# EAGLE design TeensyAmp_R5.1 (EAGLE 9.6.2)

## Sheet 1 of 3
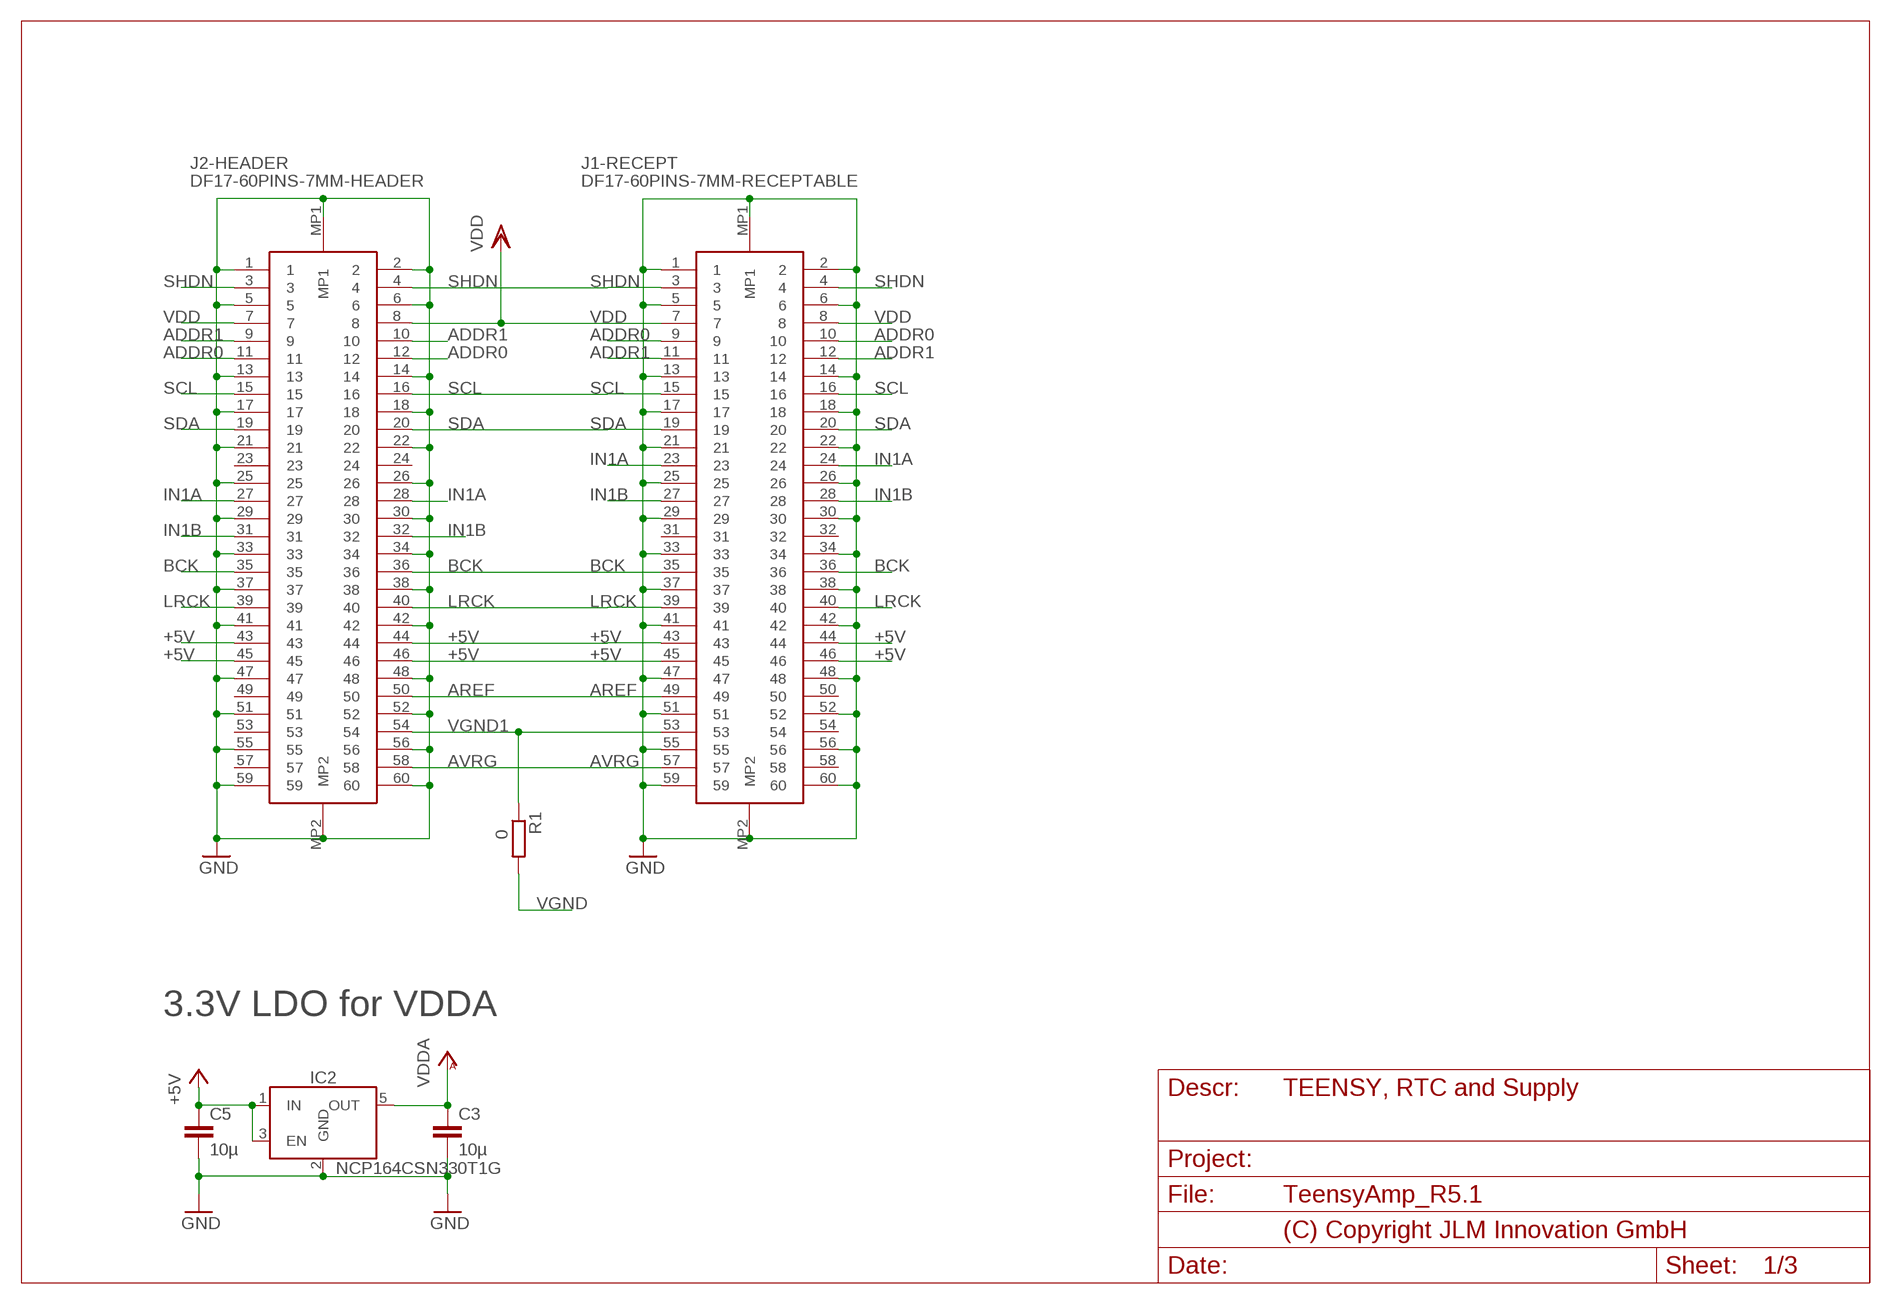
[diagram p0: schematic, sheet 1]
FRAME1 (DINA4_L): PAGE_DESCRIPTION: TEENSY, RTC and Supply

### Parts
C3  10µ  C-EUC0603  [C0603]
C5  10µ  C-EUC0603  [C0603]
IC2  NCP164CSN330T1G  LDO_ENSOT23-5  [SOT23-5]
J1-RECEPT  DF17-60PINS-7MM-RECEPTABLE  [DF173060DS05V57]
J2-HEADER  DF17-60PINS-7MM-HEADER  [DF174060DP05V57]
R1  0  R_JLMR0603  [R0603]

### Nets
+5V: C5.1 IC2.1(IN) IC2.3(EN) J1-RECEPT.43 J1-RECEPT.44 J1-RECEPT.45 J1-RECEPT.46 J2-HEADER.43 J2-HEADER.44 J2-HEADER.45 J2-HEADER.46
ADDR0: J1-RECEPT.9 J1-RECEPT.10 J2-HEADER.11 J2-HEADER.12
ADDR1: J1-RECEPT.11 J1-RECEPT.12 J2-HEADER.9 J2-HEADER.10 ; also sheet 2,3
AREF: J1-RECEPT.49 J2-HEADER.50 ; also sheet 2,3
AVRG: J1-RECEPT.57 J2-HEADER.58 ; also sheet 2,3
BCK: J1-RECEPT.35 J1-RECEPT.36 J2-HEADER.35 J2-HEADER.36 ; also sheet 2,3
GND: C3.2 C5.2 IC2.2(GND) J1-RECEPT.1 J1-RECEPT.2 J1-RECEPT.5 J1-RECEPT.6 J1-RECEPT.13 J1-RECEPT.14 J1-RECEPT.17 J1-RECEPT.18 J1-RECEPT.21 J1-RECEPT.22 J1-RECEPT.25 J1-RECEPT.26 J1-RECEPT.29 J1-RECEPT.30 J1-RECEPT.33 J1-RECEPT.34 J1-RECEPT.37 J1-RECEPT.38 J1-RECEPT.41 J1-RECEPT.42 J1-RECEPT.47 J1-RECEPT.48 J1-RECEPT.51 J1-RECEPT.52 J1-RECEPT.55 J1-RECEPT.56 J1-RECEPT.59 J1-RECEPT.60 J1-RECEPT.MP1 J1-RECEPT.MP2 J2-HEADER.1 J2-HEADER.2 J2-HEADER.5 J2-HEADER.6 J2-HEADER.13 J2-HEADER.14 J2-HEADER.17 J2-HEADER.18 J2-HEADER.21 J2-HEADER.22 J2-HEADER.25 J2-HEADER.26 J2-HEADER.29 J2-HEADER.30 J2-HEADER.33 J2-HEADER.34 J2-HEADER.37 J2-HEADER.38 J2-HEADER.41 J2-HEADER.42 J2-HEADER.47 J2-HEADER.48 J2-HEADER.51 J2-HEADER.52 J2-HEADER.55 J2-HEADER.56 J2-HEADER.59 J2-HEADER.60 J2-HEADER.MP1 J2-HEADER.MP2 ; also sheet 2,3
IN1A: J1-RECEPT.23 J1-RECEPT.24 J2-HEADER.27 J2-HEADER.28 ; also sheet 2,3
IN1B: J1-RECEPT.27 J1-RECEPT.28 J2-HEADER.31 J2-HEADER.32
LRCK: J1-RECEPT.39 J1-RECEPT.40 J2-HEADER.39 J2-HEADER.40 ; also sheet 2,3
SCL: J1-RECEPT.15 J1-RECEPT.16 J2-HEADER.15 J2-HEADER.16 ; also sheet 2,3
SDA: J1-RECEPT.19 J1-RECEPT.20 J2-HEADER.19 J2-HEADER.20 ; also sheet 2,3
SHDN: J1-RECEPT.3 J1-RECEPT.4 J2-HEADER.3 J2-HEADER.4 ; also sheet 2,3
VDD: J1-RECEPT.7 J1-RECEPT.8 J2-HEADER.7 J2-HEADER.8 ; also sheet 2,3
VDDA: C3.1 IC2.5(OUT) ; also sheet 2,3
VGND: R1.2 ; also sheet 2,3
VGND1: J1-RECEPT.53 J2-HEADER.54 R1.1
Unconnected: J1-RECEPT.31 J1-RECEPT.32 J1-RECEPT.50 J1-RECEPT.54 J1-RECEPT.58 J2-HEADER.23 J2-HEADER.24 J2-HEADER.49 J2-HEADER.53 J2-HEADER.57

### Notes on the sheet
- 3.3V LDO for VDDA

## Sheet 2 of 3
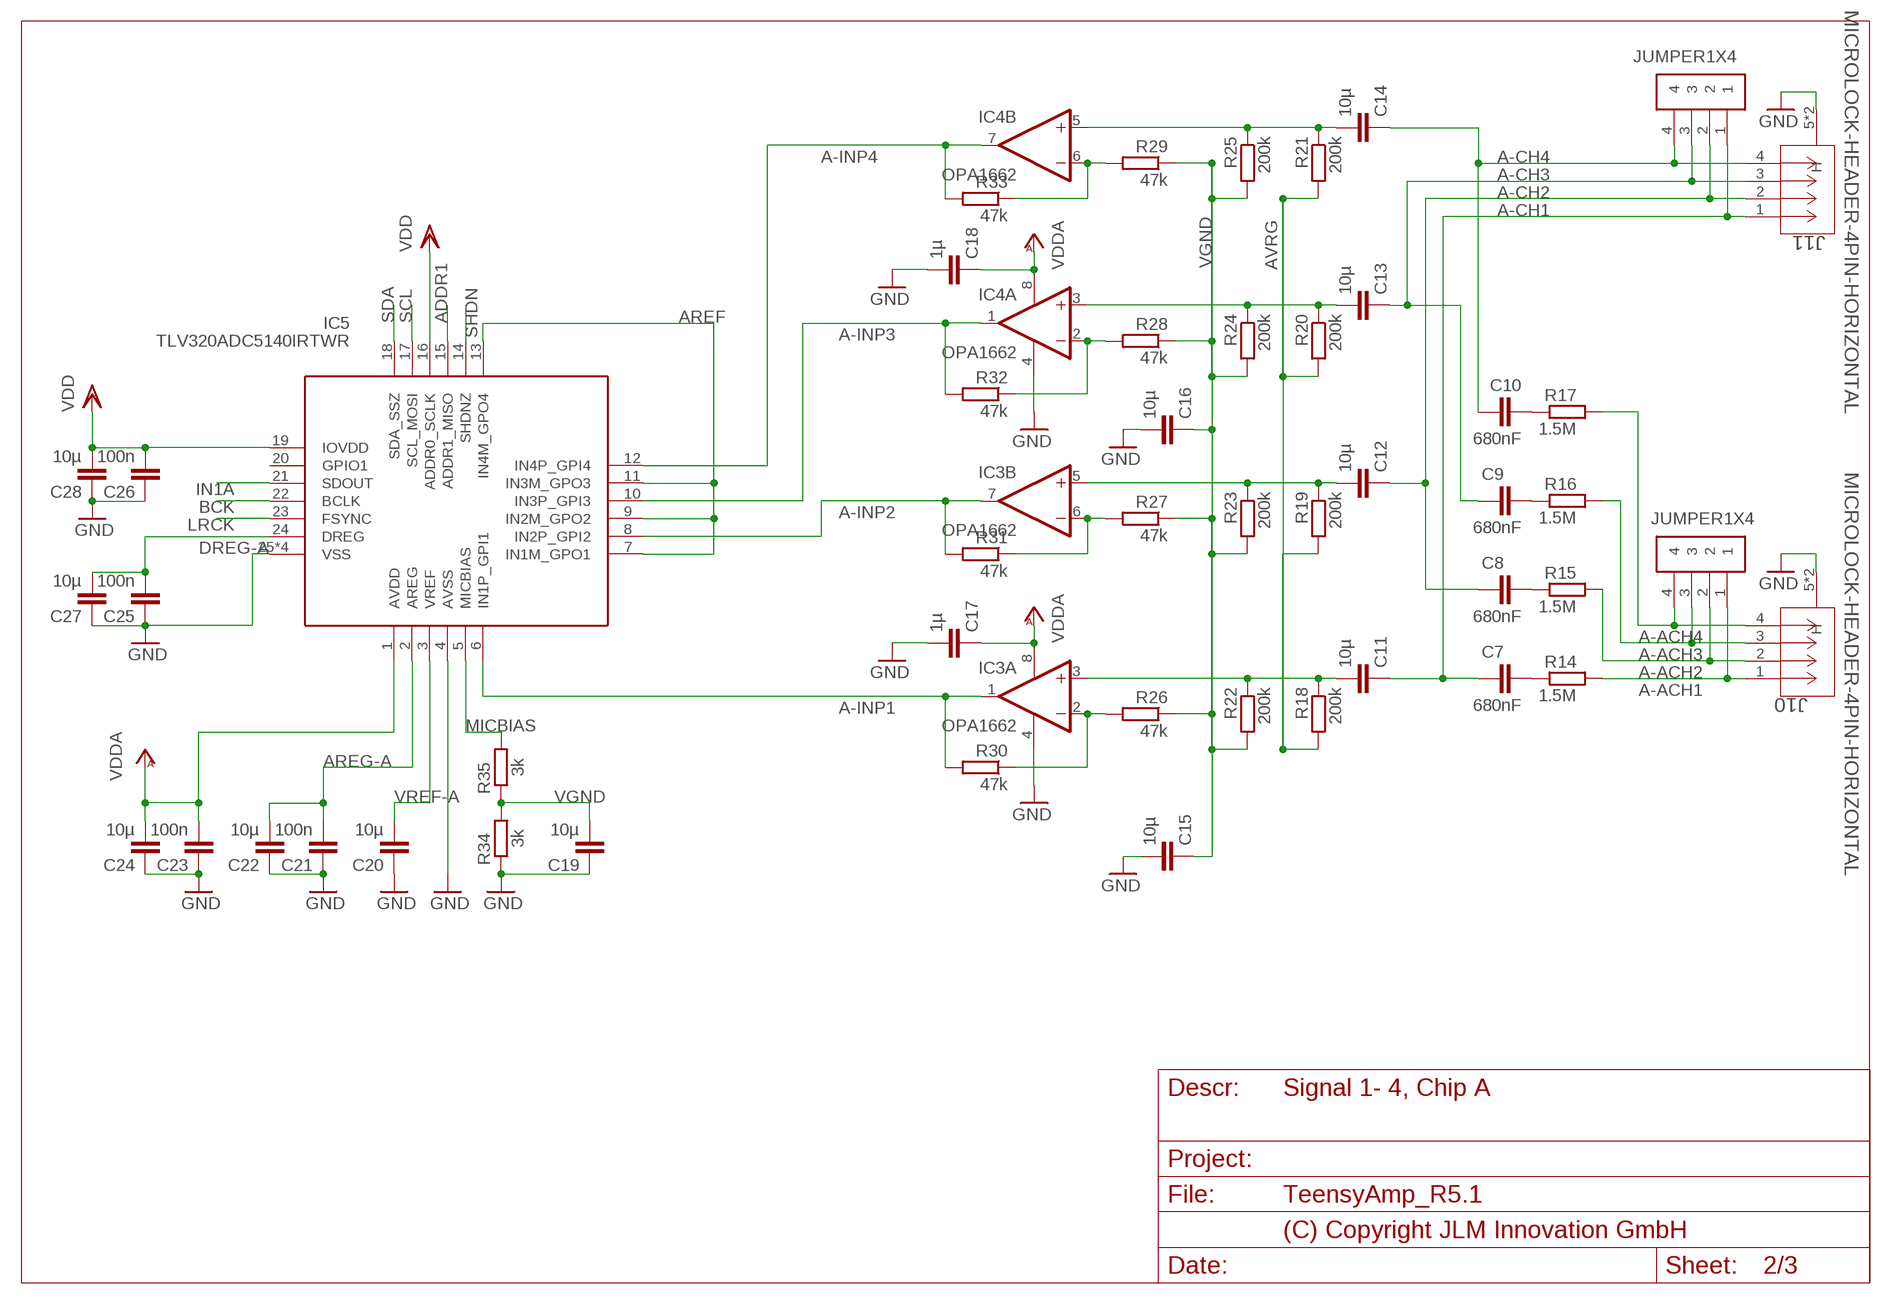
[diagram p1: schematic, sheet 2]
FRAME2 (DINA4_L): PAGE_DESCRIPTION: Signal 1- 4, Chip A

### Parts
C7  680nF  C-EUC0805  [C0805]
C8  680nF  C-EUC0805  [C0805]
C9  680nF  C-EUC0805  [C0805]
C10  680nF  C-EUC0805  [C0805]
C11  10µ  C-EUC0805  [C0805]
C12  10µ  C-EUC0805  [C0805]
C13  10µ  C-EUC0805  [C0805]
C14  10µ  C-EUC0805  [C0805]
C15  10µ  C-EUC0603  [C0603]
C16  10µ  C-EUC0603  [C0603]
C17  1µ  C-EUC0603  [C0603]
C18  1µ  C-EUC0603  [C0603]
C19  10µ  C-EUC0603  [C0603]
C20  10µ  C-EUC0603  [C0603]
C21  100n  C-EUC0603  [C0603]
C22  10µ  C-EUC0603  [C0603]
C23  100n  C-EUC0603  [C0603]
C24  10µ  C-EUC0603  [C0603]
C25  100n  C-EUC0603  [C0603]
C26  100n  C-EUC0603  [C0603]
C27  10µ  C-EUC0603  [C0603]
C28  10µ  C-EUC0603  [C0603]
IC3  OPA1662  OPA2344E  [MSOP08]
IC4  OPA1662  OPA2344E  [MSOP08]
IC5  TLV320ADC5140IRTWR  [QFN50P400X400X80-25N]
J10  MICROLOCK-HEADER-4PIN-HORIZONTAL  [CONN04_5055670471_MOL]
J11  MICROLOCK-HEADER-4PIN-HORIZONTAL  [CONN04_5055670471_MOL]
J12  JUMPER1X4  [JMP1X4]
J13  JUMPER1X4  [JMP1X4]
R14  1.5M  R_JLMR0603  [R0603]
R15  1.5M  R_JLMR0603  [R0603]
R16  1.5M  R_JLMR0603  [R0603]
R17  1.5M  R_JLMR0603  [R0603]
R18  200k  R_JLMR0603  [R0603]
R19  200k  R_JLMR0603  [R0603]
R20  200k  R_JLMR0603  [R0603]
R21  200k  R_JLMR0603  [R0603]
R22  200k  R_JLMR0603  [R0603]
R23  200k  R_JLMR0603  [R0603]
R24  200k  R_JLMR0603  [R0603]
R25  200k  R_JLMR0603  [R0603]
R26  47k  R_JLMR0603  [R0603]
R27  47k  R_JLMR0603  [R0603]
R28  47k  R_JLMR0603  [R0603]
R29  47k  R_JLMR0603  [R0603]
R30  47k  R_JLMR0603  [R0603]
R31  47k  R_JLMR0603  [R0603]
R32  47k  R_JLMR0603  [R0603]
R33  47k  R_JLMR0603  [R0603]
R34  3k  R_JLMR0603  [R0603]
R35  3k  R_JLMR0603  [R0603]

### Nets
A-ACH1: J10.1 J12.1 R14.1
A-ACH2: J10.2 J12.2 R15.1
A-ACH3: J10.3 J12.3 R16.1
A-ACH4: J10.4 J12.4 R17.1
A-CH1: C7.2 C11.1 J11.1 J13.1
A-CH2: C8.2 C12.1 J11.2 J13.2
A-CH3: C9.2 C13.1 J11.3 J13.3
A-CH4: C10.2 C14.1 J11.4 J13.4
A-INP1: IC3.1(A:OUT) IC5.6(IN1P_GPI1) R30.2
A-INP2: IC3.7(B:OUT) IC5.8(IN2P_GPI2) R31.2
A-INP3: IC4.1(A:OUT) IC5.10(IN3P_GPI3) R32.2
A-INP4: IC4.7(B:OUT) IC5.12(IN4P_GPI4) R33.2
ADDR1: IC5.15(ADDR1_MISO) ; also sheet 1,3
AREF: IC5.7(IN1M_GPO1) IC5.9(IN2M_GPO2) IC5.11(IN3M_GPO3) IC5.13(IN4M_GPO4) ; also sheet 1,3
AREG-A: C21.2 C22.2 IC5.2(AREG)
AVRG: R18.2 R19.2 R20.2 R21.2 ; also sheet 1,3
BCK: IC5.22(BCLK) ; also sheet 1,3
DREG-A: C25.2 C27.2 IC5.24(DREG)
GND: C15.2 C16.2 C17.2 C18.2 C19.1 C20.1 C21.1 C22.1 C23.1 C24.1 C25.1 C26.1 C27.1 C28.1 IC3.4(A:V-) IC4.4(A:V-) IC5.4(AVSS) IC5.25(VSS) IC5.26(VSS) IC5.27(VSS) IC5.28(VSS) J10.5(H) J10.6(H) J11.5(H) J11.6(H) R34.1 ; also sheet 1,3
IN1A: IC5.21(SDOUT) ; also sheet 1,3
LRCK: IC5.23(FSYNC) ; also sheet 1,3
MICBIAS: IC5.5(MICBIAS) R35.2
N$6: C13.2 IC4.3(A:+IN) R20.1 R24.1
N$8: C14.2 IC4.5(B:+IN) R21.1 R25.1
N$9: C11.2 IC3.3(A:+IN) R18.1 R22.1
N$10: C12.2 IC3.5(B:+IN) R19.1 R23.1
N$13: IC3.6(B:-IN) R27.2 R31.1
N$15: C7.1 R14.2
N$16: C8.1 R15.2
N$18: C9.1 R16.2
N$27: C10.1 R17.2
N$31: IC4.2(A:-IN) R28.2 R32.1
N$32: IC4.6(B:-IN) R29.2 R33.1
N$33: IC3.2(A:-IN) R26.2 R30.1
SCL: IC5.17(SCL_MOSI) ; also sheet 1,3
SDA: IC5.18(SDA_SSZ) ; also sheet 1,3
SHDN: IC5.14(SHDNZ) ; also sheet 1,3
VDD: C26.2 C28.2 IC5.16(ADDR0_SCLK) IC5.19(IOVDD) ; also sheet 1,3
VDDA: C17.1 C18.1 C23.2 C24.2 IC3.8(A:V+) IC4.8(A:V+) IC5.1(AVDD) ; also sheet 1,3
VGND: C15.1 C16.1 C19.2 R22.2 R23.2 R24.2 R25.2 R26.1 R27.1 R28.1 R29.1 R34.2 R35.1 ; also sheet 1,3
VREF-A: C20.2 IC5.3(VREF)
Unconnected: IC5.20(GPIO1)

## Sheet 3 of 3
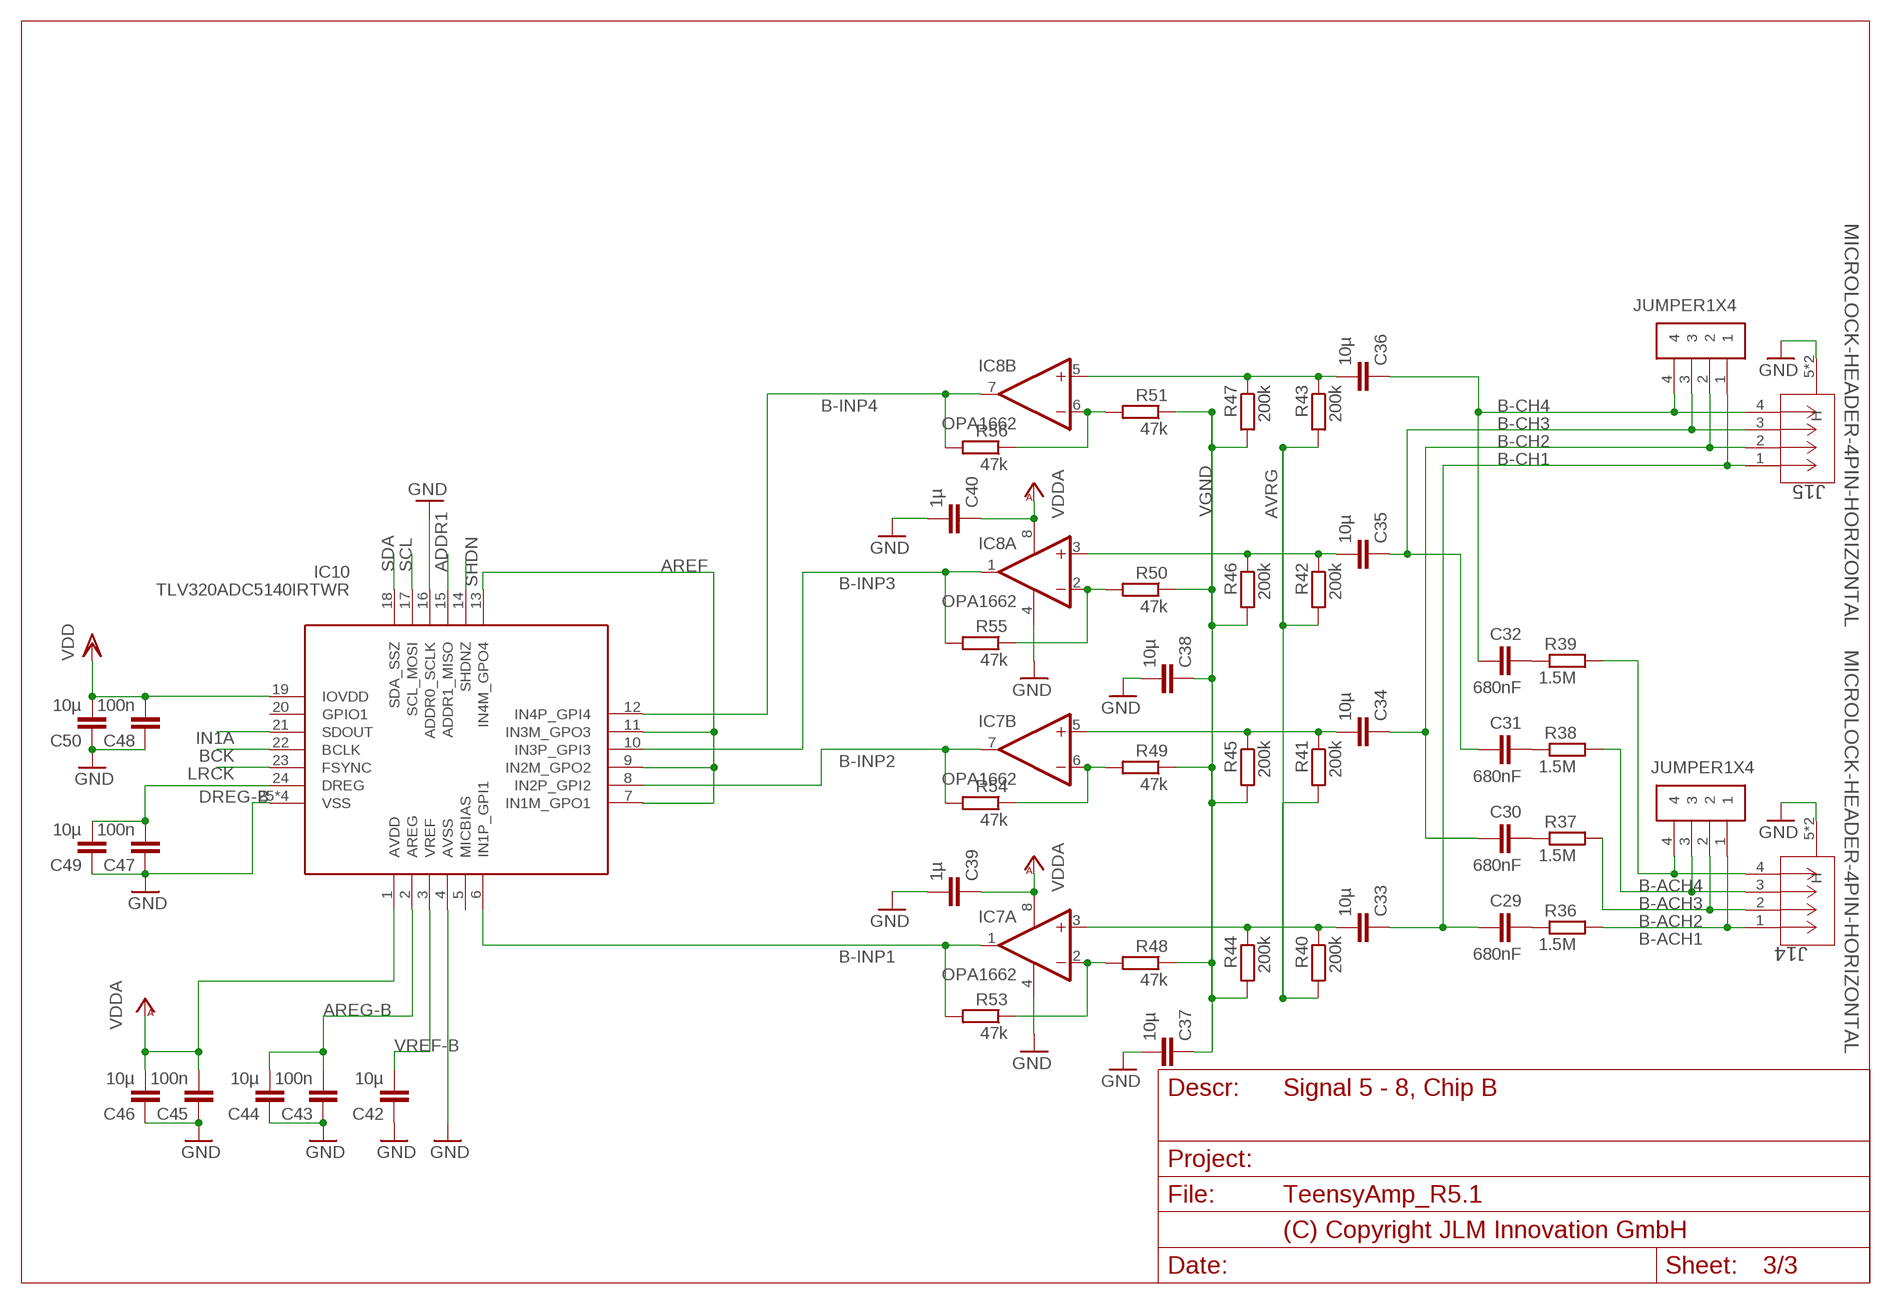
[diagram p2: schematic, sheet 3]
FRAME3 (DINA4_L): PAGE_DESCRIPTION: Signal 5 - 8, Chip B

### Parts
C29  680nF  C-EUC0805  [C0805]
C30  680nF  C-EUC0805  [C0805]
C31  680nF  C-EUC0805  [C0805]
C32  680nF  C-EUC0805  [C0805]
C33  10µ  C-EUC0805  [C0805]
C34  10µ  C-EUC0805  [C0805]
C35  10µ  C-EUC0805  [C0805]
C36  10µ  C-EUC0805  [C0805]
C37  10µ  C-EUC0603  [C0603]
C38  10µ  C-EUC0603  [C0603]
C39  1µ  C-EUC0603  [C0603]
C40  1µ  C-EUC0603  [C0603]
C42  10µ  C-EUC0603  [C0603]
C43  100n  C-EUC0603  [C0603]
C44  10µ  C-EUC0603  [C0603]
C45  100n  C-EUC0603  [C0603]
C46  10µ  C-EUC0603  [C0603]
C47  100n  C-EUC0603  [C0603]
C48  100n  C-EUC0603  [C0603]
C49  10µ  C-EUC0603  [C0603]
C50  10µ  C-EUC0603  [C0603]
IC7  OPA1662  OPA2344E  [MSOP08]
IC8  OPA1662  OPA2344E  [MSOP08]
IC10  TLV320ADC5140IRTWR  [QFN50P400X400X80-25N]
J14  MICROLOCK-HEADER-4PIN-HORIZONTAL  [CONN04_5055670471_MOL]
J15  MICROLOCK-HEADER-4PIN-HORIZONTAL  [CONN04_5055670471_MOL]
J16  JUMPER1X4  [JMP1X4]
J17  JUMPER1X4  [JMP1X4]
R36  1.5M  R_JLMR0603  [R0603]
R37  1.5M  R_JLMR0603  [R0603]
R38  1.5M  R_JLMR0603  [R0603]
R39  1.5M  R_JLMR0603  [R0603]
R40  200k  R_JLMR0603  [R0603]
R41  200k  R_JLMR0603  [R0603]
R42  200k  R_JLMR0603  [R0603]
R43  200k  R_JLMR0603  [R0603]
R44  200k  R_JLMR0603  [R0603]
R45  200k  R_JLMR0603  [R0603]
R46  200k  R_JLMR0603  [R0603]
R47  200k  R_JLMR0603  [R0603]
R48  47k  R_JLMR0603  [R0603]
R49  47k  R_JLMR0603  [R0603]
R50  47k  R_JLMR0603  [R0603]
R51  47k  R_JLMR0603  [R0603]
R53  47k  R_JLMR0603  [R0603]
R54  47k  R_JLMR0603  [R0603]
R55  47k  R_JLMR0603  [R0603]
R56  47k  R_JLMR0603  [R0603]

### Nets
ADDR1: IC10.15(ADDR1_MISO) ; also sheet 1,2
AREF: IC10.7(IN1M_GPO1) IC10.9(IN2M_GPO2) IC10.11(IN3M_GPO3) IC10.13(IN4M_GPO4) ; also sheet 1,2
AREG-B: C43.2 C44.2 IC10.2(AREG)
AVRG: R40.2 R41.2 R42.2 R43.2 ; also sheet 1,2
B-ACH1: J14.1 J16.1 R36.1
B-ACH2: J14.2 J16.2 R37.1
B-ACH3: J14.3 J16.3 R38.1
B-ACH4: J14.4 J16.4 R39.1
B-CH1: C29.2 C33.1 J15.1 J17.1
B-CH2: C30.2 C34.1 J15.2 J17.2
B-CH3: C31.2 C35.1 J15.3 J17.3
B-CH4: C32.2 C36.1 J15.4 J17.4
B-INP1: IC7.1(A:OUT) IC10.6(IN1P_GPI1) R53.2
B-INP2: IC7.7(B:OUT) IC10.8(IN2P_GPI2) R54.2
B-INP3: IC8.1(A:OUT) IC10.10(IN3P_GPI3) R55.2
B-INP4: IC8.7(B:OUT) IC10.12(IN4P_GPI4) R56.2
BCK: IC10.22(BCLK) ; also sheet 1,2
DREG-B: C47.2 C49.2 IC10.24(DREG)
GND: C37.2 C38.2 C39.2 C40.2 C42.1 C43.1 C44.1 C45.1 C46.1 C47.1 C48.1 C49.1 C50.1 IC7.4(A:V-) IC8.4(A:V-) IC10.4(AVSS) IC10.16(ADDR0_SCLK) IC10.25(VSS) IC10.26(VSS) IC10.27(VSS) IC10.28(VSS) J14.5(H) J14.6(H) J15.5(H) J15.6(H) ; also sheet 1,2
IN1A: IC10.21(SDOUT) ; also sheet 1,2
LRCK: IC10.23(FSYNC) ; also sheet 1,2
N$5: IC8.2(A:-IN) R50.2 R55.1
N$11: IC8.6(B:-IN) R51.2 R56.1
N$12: IC7.2(A:-IN) R48.2 R53.1
N$14: IC7.6(B:-IN) R49.2 R54.1
N$17: C35.2 IC8.3(A:+IN) R42.1 R46.1
N$19: C36.2 IC8.5(B:+IN) R43.1 R47.1
N$20: C33.2 IC7.3(A:+IN) R40.1 R44.1
N$21: C34.2 IC7.5(B:+IN) R41.1 R45.1
N$22: C29.1 R36.2
N$23: C30.1 R37.2
N$25: C31.1 R38.2
N$26: C32.1 R39.2
SCL: IC10.17(SCL_MOSI) ; also sheet 1,2
SDA: IC10.18(SDA_SSZ) ; also sheet 1,2
SHDN: IC10.14(SHDNZ) ; also sheet 1,2
VDD: C48.2 C50.2 IC10.19(IOVDD) ; also sheet 1,2
VDDA: C39.1 C40.1 C45.2 C46.2 IC7.8(A:V+) IC8.8(A:V+) IC10.1(AVDD) ; also sheet 1,2
VGND: C37.1 C38.1 R44.2 R45.2 R46.2 R47.2 R48.1 R49.1 R50.1 R51.1 ; also sheet 1,2
VREF-B: C42.2 IC10.3(VREF)
Unconnected: IC10.5(MICBIAS) IC10.20(GPIO1)

## Library data of the parts
C3 C5 C7-C40 C42-C50 = teensyamp:C-EU: CAPACITOR, European symbol
IC2 = teensyamp:LDO_EN; OC_FARNELL: 3367831; OC_MOUSER: 863-NCP164CSN330T1G
IC3 IC4 IC7 IC8 = teensyamp:OPA2*: Dual Operational Amplifier Low Power, Single-Supply, Rail-To-Rail Operational Amplifier Source: http://focus.ti.com/lit/ds/symlink/opa2345.pdf http://focus.ti.com .. opa241.pdf http://focus.ti.com/lit/ds/symlink/opa2134.pdf
IC5 IC10 = teensyamp:TLV320ADC5140IRTWR: 4-Channel Quad ADC Delta-Sigma 768ksps Serial 24-Pin WQFN EP T/R Source: Datasheet <https://www.ti.com/lit/gpn/TLV320ADC5140>; DESCRIPTION: 4-Channel Quad ADC Delta-Sigma 768ksps Serial 24-Pin WQFN EP T/R; HEIGHT: 0.8mm; MANUFACTURER_NAME: Texas Instruments; MANUFACTURER_PART_NUMBER: TLV320ADC5140IRTWR; MOUSER_PART_NUMBER: 595-V320ADC5140IRTWR; MOUSER_PRICE-STOCK: https://www.mouser.co.uk/ProductDetail/Texas-Instruments/TLV320ADC5140IRTWR?qs=Cb2nCFKsA8oyrIT%252Bcv2aDg%3D%3D
J1-RECEPT = teensyamp:DF17-60PINS-7MM-RECEPTABLE: Hirose DF17 Series 0.5mm 60 Way 2 Row Straight PCB Socket Surface Mount Board to Board Source: Datasheet <https://www.hirose.com/product/document?clcode=CL0683-0006-3-57&productname=DF17(3.0)-60DS-0.5V(57)&series=DF17&documenttype=2DDrawing&lang=en&documentid=0000993481>; DESCRIPTION: Hirose DF17 Series 0.5mm 60 Way 2 Row Straight PCB Socket Surface Mount Board to Board; HEIGHT: 3.65mm; MANUFACTURER_NAME: Hirose; MANUFACTURER_PART_NUMBER: DF17(3.0)-60DS-0.5V(57); MOUSER_PART_NUMBER: 798-DF173060DS05V57; MOUSER_PRICE-STOCK: https://www.mouser.co.uk/ProductDetail/Hirose-Connector/DF173.0-60DS-0.5V57?qs=eDUdFcBPps3N4nQ82enQ9g%3D%3D
J2-HEADER = teensyamp:DF17-60PINS-7MM-HEADER: Hirose DF17 Series, 0.5mm Pitch 60 Way 2 Row Straight PCB Header, Solder Termination, 0.3A Source: Datasheet <https://www.hirose.com/en/product/document?clcode=CL0683-0126-5-57&productname=DF17(4.0)-60DP-0.5V(57)&series=DF17&documenttype=2DDrawing&lang=en&documentid=0000994398>; DESCRIPTION: Hirose DF17 Series, 0.5mm Pitch 60 Way 2 Row Straight PCB Header, Solder Termination, 0.3A; HEIGHT: 6.45mm; MANUFACTURER_NAME: Hirose; MANUFACTURER_PART_NUMBER: DF17(4.0)-60DP-0.5V(57); MOUSER_PART_NUMBER: 798-DF174060DP05V57; MOUSER_PRICE-STOCK: https://www.mouser.co.uk/ProductDetail/Hirose-Connector/DF174.0-60DP-0.5V57?qs=eDUdFcBPps3I8b9%252Bfsb1tQ%3D%3D
J10 J11 J14 J15 = teensyamp:MICROLOCK-HEADER-4PIN-HORIZONTAL: molex micro-lock plus horizontal header 4 pins; COPYRIGHT: Copyright (C) 2025 Ultra Librarian. All rights reserved.; MANUFACTURER_PART_NUMBER: 5055670471; MFR_NAME: Molex Connector Corporation
J12 J13 J16 J17 = teensyamp:JUMPER1X4
R1 R14-R51 R53-R56 = teensyamp:R_JLM: RESISTOR, European symbol

## Net classes
0 default: clearance 0.205 mm

## Board
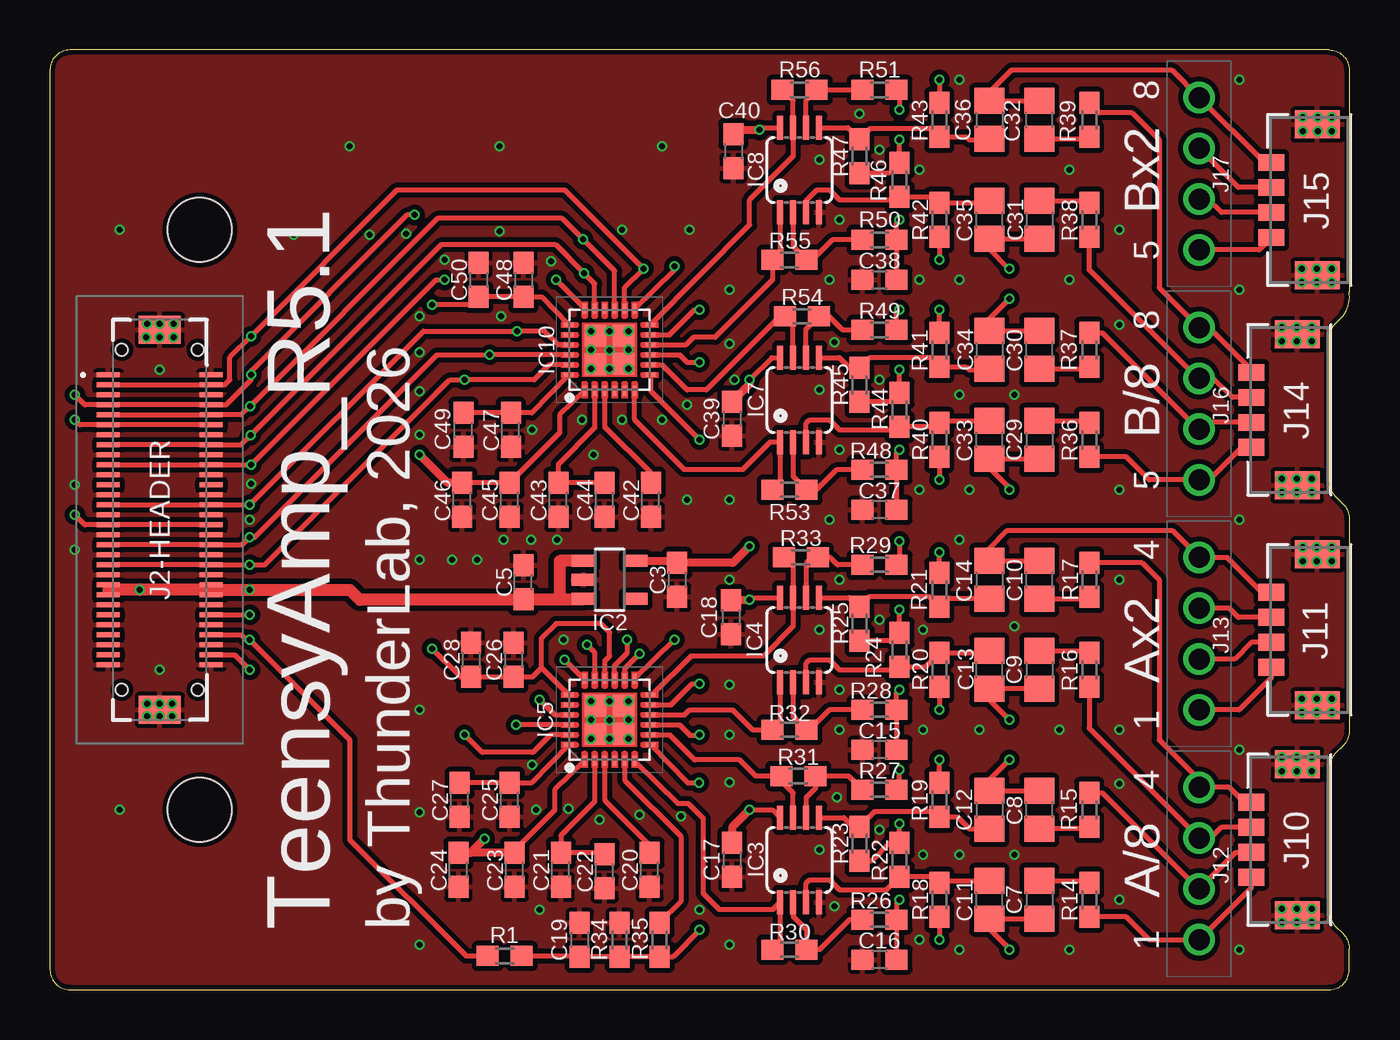
[diagram p3: board, top side]
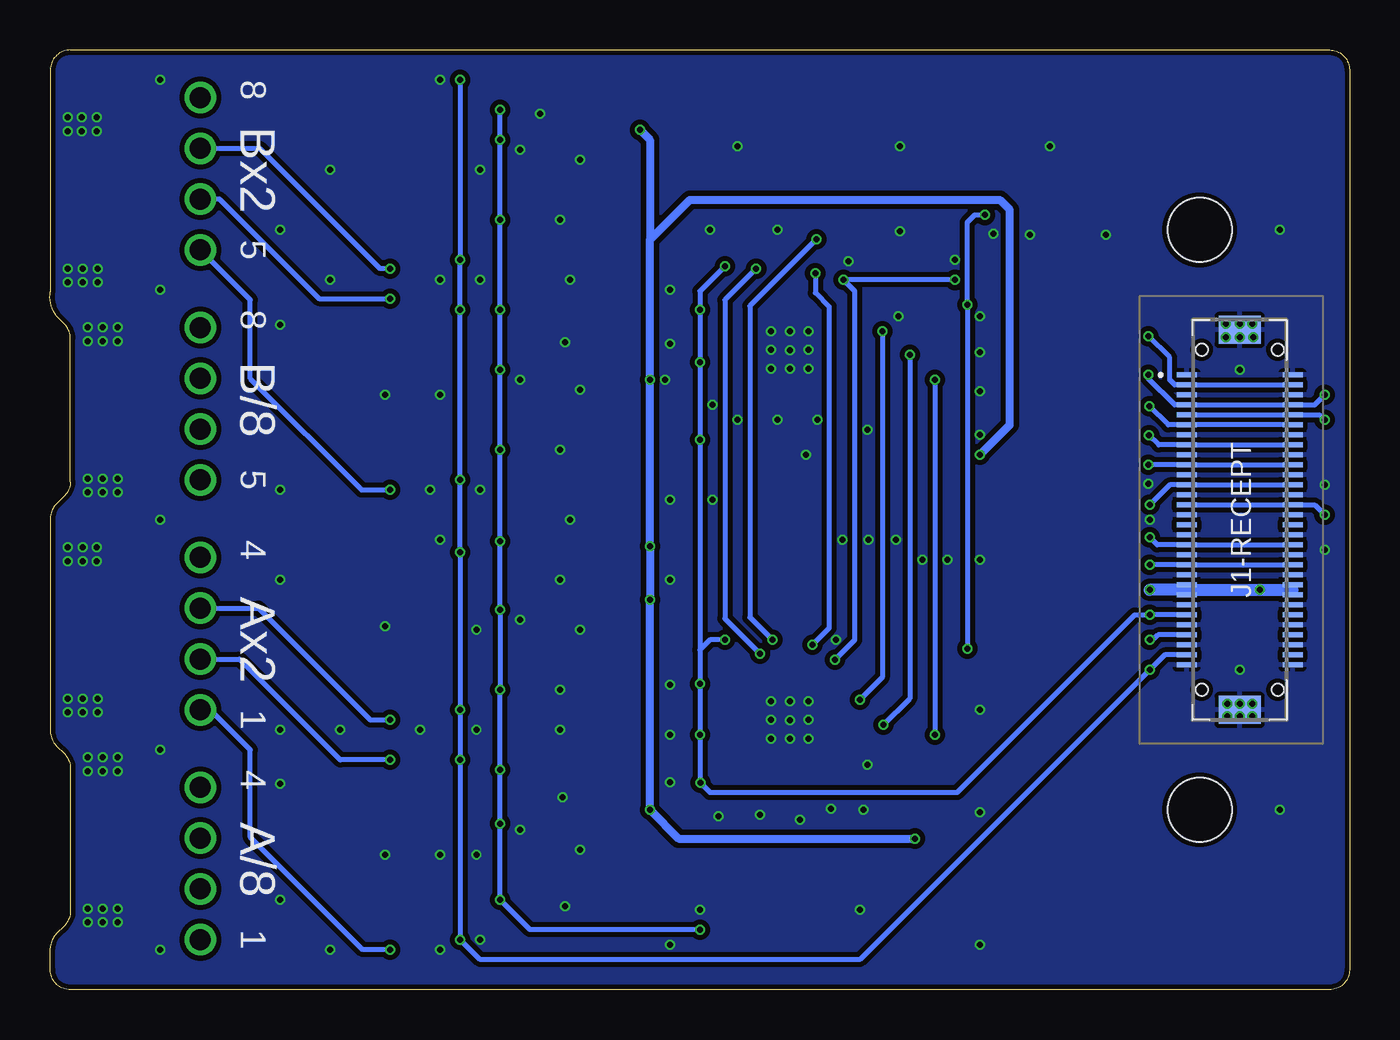
[diagram p4: board, bottom side, seen from below]

Size 65.02 x 47 mm. Coordinates in mm from the lower left corner, seen from the top.
Outline: 0,46 0,1 arc90 1,0 64,0 arc90 65,1 65,2.09 arc45 64.71,2.79 64.29,3.21 arc-45 64,3.91 64,11.09 arc-45 64.29,11.79 64.71,12.21 arc45 65,12.91 65,23.59 arc45 64.71,24.29 64.29,24.71 arc-45 64,25.41 64,32.59 arc-45 64.29,33.29 64.71,33.71 arc45 65,34.91 65,46 arc90 64,47 1,47 arc90 0,46
Copper layers (1*16): Top 0.018mm / dielectric 1.55mm / Bottom 0.018mm
Design rules "Multi-CB_2L_100цm-Tracks_OL35цm *": minimum track width 0.1mm, minimum drill 0.2mm, track to track 0.1mm, track to pad 0.1mm, pad to pad 0.1mm, via to via 0.1mm, smd to smd 0mil, copper to edge 0.2mm, drill to drill 0.2mm, minimum pad ring 0.125mm, minimum via ring 0.1mm, stop-mask expansion 2mil, vias tented up to drill 0.45mm, thermal gap 0.2mm
Holes 3.2 mm at 7.5,9 7.5,38

### Footprints (pad centres in the part's own frame; a part is rotated, then mirrored left to right if it is on the bottom)
C0603 = smd 1.1 x 1: 1 -0.85,0; 2 0.85,0
C0805 = smd 1.3 x 1.5: 1 -0.95,0; 2 0.95,0
SOT23-5 = smd 0.6 x 1.2: 1 -0.95,-1.306; 2 0,-1.306; 3 0.95,-1.306; 4 0.95,1.306; 5 -0.95,1.306
MSOP08 = smd 0.3 x 1.2: 1 -0.976,-2.113; 2 -0.326,-2.113; 3 0.324,-2.113; 4 0.974,-2.113; 5 0.974,2.112; 6 0.324,2.112; 7 -0.326,2.112; 8 -0.976,2.112
QFN50P400X400X80-25N = smd 0.5 x 0.2: 1 -2.05,1.25; 2 -2.05,0.75; 3 -2.05,0.25; 4 -2.05,-0.25; 5 -2.05,-0.75; 6 -2.05,-1.25; 13 2.05,-1.25; 14 2.05,-0.75; 15 2.05,-0.25; 16 2.05,0.25; 17 2.05,0.75; 18 2.05,1.25 | smd 0.2 x 0.5: 7 -1.25,-2.05; 8 -0.75,-2.05; 9 -0.25,-2.05; 10 0.25,-2.05; 11 0.75,-2.05; 12 1.25,-2.05; 19 1.25,2.05; 20 0.75,2.05; 21 0.25,2.05; 22 -0.25,2.05; 23 -0.75,2.05; 24 -1.25,2.05 | smd 1.1 x 1.1: 25 -0.71,0.7; 26 0.7,0.7; 27 -0.7,-0.7; 28 0.7,-0.7
DF173060DS05V57 = smd 0.25 x 1: 1 -7.25,-2.65; 2 -7.25,2.65; 3 -6.75,-2.65; 4 -6.75,2.65; 5 -6.25,-2.65; 6 -6.25,2.65; 7 -5.75,-2.65; 8 -5.75,2.65; 9 -5.25,-2.65; 10 -5.25,2.65; 11 -4.75,-2.65; 12 -4.75,2.65; 13 -4.25,-2.65; 14 -4.25,2.65; 15 -3.75,-2.65; 16 -3.75,2.65; 17 -3.25,-2.65; 18 -3.25,2.65; 19 -2.75,-2.65; 20 -2.75,2.65; 21 -2.25,-2.65; 22 -2.25,2.65; 23 -1.75,-2.65; 24 -1.75,2.65; 25 -1.25,-2.65; 26 -1.25,2.65; 27 -0.75,-2.65; 28 -0.75,2.65; 29 -0.25,-2.65; 30 -0.25,2.65; 31 0.25,-2.65; 32 0.25,2.65; 33 0.75,-2.65; 34 0.75,2.65; 35 1.25,-2.65; 36 1.25,2.65; 37 1.75,-2.65; 38 1.75,2.65; 39 2.25,-2.65; 40 2.25,2.65; 41 2.75,-2.65; 42 2.75,2.65; 43 3.25,-2.65; 44 3.25,2.65; 45 3.75,-2.65; 46 3.75,2.65; 47 4.25,-2.65; 48 4.25,2.65; 49 4.75,-2.65; 50 4.75,2.65; 51 5.25,-2.65; 52 5.25,2.65; 53 5.75,-2.65; 54 5.75,2.65; 55 6.25,-2.65; 56 6.25,2.65; 57 6.75,-2.65; 58 6.75,2.65; 59 7.25,-2.65; 60 7.25,2.65 | smd 1.4 x 2.1: MP1 -9.5,0; MP2 9.5,0 | hole 0.6: -8.5,-1.9; 8.5,-1.9
DF174060DP05V57 = smd 0.25 x 1.15: 1 -7.25,-2.575; 2 -7.25,2.575; 3 -6.75,-2.575; 4 -6.75,2.575; 5 -6.25,-2.575; 6 -6.25,2.575; 7 -5.75,-2.575; 8 -5.75,2.575; 9 -5.25,-2.575; 10 -5.25,2.575; 11 -4.75,-2.575; 12 -4.75,2.575; 13 -4.25,-2.575; 14 -4.25,2.575; 15 -3.75,-2.575; 16 -3.75,2.575; 17 -3.25,-2.575; 18 -3.25,2.575; 19 -2.75,-2.575; 20 -2.75,2.575; 21 -2.25,-2.575; 22 -2.25,2.575; 23 -1.75,-2.575; 24 -1.75,2.575; 25 -1.25,-2.575; 26 -1.25,2.575; 27 -0.75,-2.575; 28 -0.75,2.575; 29 -0.25,-2.575; 30 -0.25,2.575; 31 0.25,-2.575; 32 0.25,2.575; 33 0.75,-2.575; 34 0.75,2.575; 35 1.25,-2.575; 36 1.25,2.575; 37 1.75,-2.575; 38 1.75,2.575; 39 2.25,-2.575; 40 2.25,2.575; 41 2.75,-2.575; 42 2.75,2.575; 43 3.25,-2.575; 44 3.25,2.575; 45 3.75,-2.575; 46 3.75,2.575; 47 4.25,-2.575; 48 4.25,2.575; 49 4.75,-2.575; 50 4.75,2.575; 51 5.25,-2.575; 52 5.25,2.575; 53 5.75,-2.575; 54 5.75,2.575; 55 6.25,-2.575; 56 6.25,2.575; 57 6.75,-2.575; 58 6.75,2.575; 59 7.25,-2.575; 60 7.25,2.575 | smd 1.4 x 2.1: MP1 -9.5,0; MP2 9.5,0 | hole 0.6: -8.5,-1.9; 8.5,-1.9
CONN04_5055670471_MOL = smd 0.838 x 1.295: 1 1.875,-1.894; 2 0.625,-1.894; 3 -0.625,-1.894; 4 -1.875,-1.894 | smd 1.397 x 2.261: 5 -3.775,0.401; 6 3.775,0.401
JMP1X4 = drill 1.05 pad 1.575: 1 0,0; 2 2.54,0; 3 5.08,0; 4 7.62,0
R0603 = smd 1.1 x 1: 1 -0.85,0; 2 0.85,0

### Placement (x,y rotation side)
C3  31.38,20.5 270 top
C5  23.69,20.38 90 top
C7  49.5,4.5 270 top
C8  49.5,9 90 top
C9  49.5,16 270 top
C10  49.5,20.5 90 top
C11  47,4.5 90 top
C12  47,9 270 top
C13  47,16 90 top
C14  47,20.5 270 top
C15  41.5,12 180 top
C16  41.5,1.5 180 top
C17  34.12,6.5 270 top
C18  34.06,18.62 270 top
C19  26.5,2.5 270 top
C20  30,6 90 top
C21  25.56,6 90 top
C22  27.75,5.94 90 top
C23  23.25,6 90 top
C24  20.44,6 90 top
C25  23,9.5 90 top
C26  23.19,16.5 270 top
C27  20.5,9.5 90 top
C28  21.06,16.5 270 top
C29  49.5,27.5 270 top
C30  49.5,32 90 top
C31  49.5,38.5 270 top
C32  49.5,43.5 90 top
C33  47,27.5 90 top
C34  47,32 270 top
C35  47,38.5 90 top
C36  47,43.5 270 top
C37  41.5,24 180 top
C38  41.5,35.5 180 top
C39  34.12,28.56 270 top
C40  34.19,41.94 270 top
C42  30.06,24.5 90 top
C43  25.44,24.5 90 top
C44  27.75,24.5 90 top
C45  23,24.5 90 top
C46  20.62,24.5 90 top
C47  23.06,28 90 top
C48  23.69,35.5 270 top
C49  20.69,28 90 top
C50  21.44,35.5 270 top
IC2  28,20.5 270 top
IC3  37.5,6.5 0 top
IC4  37.5,17.5 0 top
IC5  28,13.5 90 top
IC7  37.5,29.5 0 top
IC8  37.5,41 0 top
IC10  28,32 90 top
J1-RECEPT  5.5,23.5 270 bottom
J2-HEADER  5.5,23.5 270 top
J10  62,7.5 270 top
J11  63,18 270 top
J12  57.5,2.5 90 top
J13  57.5,14 90 top
J14  62,29 270 top
J15  63,39.5 270 top
J16  57.5,25.5 90 top
J17  57.5,37 90 top
R1  22.75,1.69 0 top
R14  52,4.5 90 top
R15  52,9 270 top
R16  52,16 90 top
R17  52,20.5 270 top
R18  44.5,4.5 270 top
R19  44.5,9.5 90 top
R20  44.5,16 270 top
R21  44.5,20 90 top
R22  42.5,6.5 90 top
R23  40.5,7.31 270 top
R24  42.5,17 90 top
R25  40.5,18.31 270 top
R26  41.5,3.5 180 top
R27  41.5,10 180 top
R28  41.5,14 180 top
R29  41.5,21.25 180 top
R30  37,2 180 top
R31  37.44,10.69 180 top
R32  37,13 180 top
R33  37.56,21.62 180 top
R34  28.5,2.5 270 top
R35  30.5,2.5 90 top
R36  52,27.5 90 top
R37  52,32 270 top
R38  52,38.5 90 top
R39  52,43.5 270 top
R40  44.5,27.5 270 top
R41  44.5,32 90 top
R42  44.5,38.5 270 top
R43  44.5,43.5 90 top
R44  42.5,29 90 top
R45  40.5,30.25 270 top
R46  42.5,40.5 90 top
R47  40.5,41.69 270 top
R48  41.5,26 180 top
R49  41.5,33 180 top
R50  41.5,37.5 180 top
R51  41.5,45 180 top
R53  37,25 180 top
R54  37.62,33.69 180 top
R55  37,36.5 180 top
R56  37.5,45 180 top

### Tracks (layer width: path | path; a pad name or v marks a point on that pad's centre or on a via)
+5V  (via drill 0.3)
  Top 0.254: J2-HEADER.44 8.07,20 J2-HEADER.46 | J2-HEADER.43 2.92,20 J2-HEADER.45
  Top 0.61: IC2.1 25.5,21.45 25.5,19.52 | 25.5,19.52 C5.1 23.66,19.5 15.5,19.5 15,20 11,20 v10,20 8.07,20 v4.5,20 2.92,20 | 25.5,19.52 26.67,19.52 IC2.3
  Bottom 0.254: J1-RECEPT.43 8.15,20 J1-RECEPT.45 | J1-RECEPT.44 2.85,20 J1-RECEPT.46
  Bottom 0.61: v10,20 8.15,20 v4.5,20 2.85,20
A-ACH1
  Top 0.254: R14.1 53.85,3.65 55,2.5 J12.1 60.11,5.11 J10.1
A-ACH2
  Top 0.254: J10.2 59.34,6.88 J12.2 57.46,5.04 52.65,9.85 R15.1
A-ACH3
  Top 0.254: R16.1 52,13.08 J12.3 58.06,7.58 58.61,8.12 J10.3
A-ACH4
  Top 0.254: R17.1 54.65,21.35 55.5,20.5 55.5,12.5 57.5,10.5 J12.4 59,10.12 59.74,9.38 J10.4
A-CH1  (via drill 0.3)
  Top 0.254: v48,2 48,2.05 47,3.05 C11.1 C7.2 | J11.1 61.11,15.61 59.5,14 J13.1
  Bottom 0.254: v48,2 49.38,2 55,7.62 55,12 57,14 J13.1
A-CH2  (via drill 0.3)
  Top 0.254: C8.2 C12.1 47,10.5 v48,11.5 | J11.2 60.11,17.38 59.27,16.54 J13.2
  Bottom 0.254: v48,11.5 50.5,11.5 55.54,16.54 J13.2
A-CH3  (via drill 0.3)
  Top 0.254: J11.3 59.45,18.62 59,19.08 J13.3 | C9.2 C13.1 47,14.5 v48,13.5
  Bottom 0.254: J13.3 54.58,19.08 49,13.5 v48,13.5
A-CH4
  Top 0.254: J11.4 60.62,19.88 58.88,21.62 J13.4 56.15,22.97 47.91,22.97 47,22.06 C14.1 C10.2
A-INP1
  Top 0.254: R30.2 36.52,2.37 IC3.1 36.15,4.01 33.49,4.01 32.69,4.81 32.69,8.56 31.94,9.31 31.44,9.31 IC5.6
A-INP2
  Top 0.254: IC3.7 37.17,9.85 36.59,10.44 R31.2 35.31,10.69 34.5,11.5 32.25,11.5 31,12.75 IC5.8
A-INP3
  Top 0.254: IC4.1 36.52,13.37 R32.2 35.15,13 34.15,14 32,14 31.75,13.75 IC5.10
A-INP4
  Top 0.254: R33.2 36.91,21.62 37.17,21.36 IC4.7 37.17,18.17 35.69,16.69 32.06,16.69 30.12,14.75 IC5.12
ADDR0  (via drill 0.3)
  Top 0.254: J2-HEADER.12 J2-HEADER.11 1.5,28.25 v1.25,28.5
  Bottom 0.254: J1-RECEPT.9 J1-RECEPT.10 1.5,28.75 v1.25,28.5
ADDR1  (via drill 0.3)
  Top 0.254: IC10.15 28.25,35.95 v26.67,37.53 25.62,38.58 19.41,38.58 v10.01,29.18 9.57,28.75 J2-HEADER.10 J2-HEADER.9 | v28.88,17.5 28.88,16.84 28.25,16.21 IC5.15
  Bottom 0.254: v26.67,37.53 30,34.2 30,18.62 v28.88,17.5 | v10.01,29.18 9.07,28.25 8.5,28.25 J1-RECEPT.11 J1-RECEPT.12
AREF  (via drill 0.3)
  Top 0.254: IC5.11 31.08,14.25 32.12,15.29 v32.5,15.29 | v31.25,17.5 IC5.13 | IC5.9 31.5,13.25 32.03,12.72 32.46,12.72 v32.5,12.76 | v31.25,36.19 31.25,36 IC10.13 | IC10.9 31.5,31.75 31.88,31.38 v32.5,31.38 | J2-HEADER.50 v10,18.75 | IC5.7 31.91,10.34 v32.47,10.34 | IC10.7 30.05,29.95 v32.5,27.5 | IC10.11 31,32.75 32.25,34 v32.5,34
  Bottom 0.254: 32.5,17 v32.5,15.29 v32.5,12.76 32.5,10.38 v32.47,10.34 32,9.88 19.62,9.88 10.75,18.75 v10,18.75 J1-RECEPT.49 | v31.25,36.19 32.5,34.94 v32.5,34 v32.5,31.38 v32.5,27.5 32.5,17 | 32.5,17 32,17.5 v31.25,17.5
AREG-A
  Top 0.254: IC5.2 27.25,9.41 25.56,7.72 C21.2 27.69,6.85 C22.2
AREG-B
  Top 0.254: IC10.2 27.25,28.1 25.44,26.29 C43.2 C44.2
AVRG  (via drill 0.3)
  Top 0.254: R21.2 v44.5,21.88 | R20.2 v44.5,14 | R19.2 v44.5,11.5 | R18.2 v44.5,2.5 | R40.2 v44.5,25.5 | R41.2 v44.5,34 | R42.2 v44.5,36.5 | v44.5,45.5 R43.2 | J2-HEADER.58 9.25,16.75 v10,16
  Bottom 0.254: v44.5,45.5 v44.5,36.5 v44.5,34 v44.5,25.5 v44.5,21.88 v44.5,14 v44.5,11.5 v44.5,2.5 43.5,1.5 24.5,1.5 v10,16 9.25,16.75 J1-RECEPT.57
B-ACH1
  Top 0.254: J14.1 59.62,27.12 58,25.5 J16.1 55,25.5 53.85,26.65 R36.1
B-ACH2
  Top 0.254: J14.2 58.15,28.38 57.81,28.04 J16.2 57.46,28.04 52.65,32.85 R37.1
B-ACH3
  Top 0.254: J14.3 59.14,29.62 58.19,30.58 J16.3 57.42,30.58 52,36 R38.1
B-ACH4
  Top 0.254: J14.4 60.11,31.01 58,33.12 J16.4 55.5,35.12 55.5,42.5 54.15,43.85 52.5,43.85 R39.1
B-CH1  (via drill 0.3)
  Top 0.254: J15.1 61.11,37.61 60.5,37 J17.1 | C29.2 C33.1 47,26.11 48,25.11 v48,25
  Bottom 0.254: v48,25 49.44,25 55,30.56 55,34.5 J17.1
B-CH2  (via drill 0.3)
  Top 0.254: J15.2 58.61,38.88 57.94,39.54 J17.2 | C30.2 C34.1 47,33.56 v48,34.56
  Bottom 0.254: v48,34.56 51.56,34.56 56.54,39.54 J17.2
B-CH3  (via drill 0.3)
  Top 0.254: J17.3 59.45,40.12 J15.3 | C31.2 C35.1 47,37.05 47.99,36.06 v48,36.06
  Bottom 0.254: v48,36.06 48.5,36.06 54.52,42.08 J17.3
B-CH4
  Top 0.254: J15.4 60.74,41.38 J17.4 56.12,46 48.12,46 47,44.88 C36.1 C32.2
B-INP1
  Top 0.254: R53.2 36.52,25.37 IC7.1 36.02,27.39 34.65,26.01 31.74,26.01 29.25,28.5 IC10.6
B-INP2
  Top 0.254: IC7.7 37.17,33.29 R54.2 36.52,33.69 32.84,30 31.88,30 30.62,31.25 IC10.8
B-INP3
  Top 0.254: IC8.1 36.52,36.87 R55.2 36.15,35.5 33.27,32.62 32.19,32.62 31.81,32.25 IC10.10
B-INP4
  Top 0.254: R56.2 37.17,44.48 IC8.7 37.17,41.67 35,39.5 35,38.25 IC10.12
BCK  (via drill 0.3)
  Top 0.254: IC10.22 v22,31.75 19.38,31.75 10.25,22.62 v10,22.62 9.62,22.25 J2-HEADER.36 J2-HEADER.35 | IC5.22 v23.31,13.25
  Bottom 0.254: v23.31,13.25 22,14.56 v22,31.75 | v10,22.62 9.62,22.25 J1-RECEPT.35 J1-RECEPT.36
DREG-A
  Top 0.254: C27.2 C25.2 24.09,10.35 IC5.24
DREG-B
  Top 0.254: C49.2 C47.2 24.1,28.85 IC10.24
GND  (via drill 0.3)
  Top 0.254: J1-RECEPT.MP1 v5.5,33.31 | J1-RECEPT.MP1 5.81,33.31 v6.19,33.31 | J1-RECEPT.MP1 v5.5,32.62 | J1-RECEPT.MP1 5.81,33 v6.19,32.62 | J1-RECEPT.MP1 5.19,33 v4.81,32.62 | IC10.26 27.54,32.94 v28,32.94 | IC5.26 27.54,14.44 v28,14.44
  other vias: 61.62,33.12 63.12,33.12 62.38,33.12 61.62,32.44 62.38,32.44 63.12,32.44 61.62,25.56 63.12,25.56 62.38,25.56 61.62,24.88 62.38,24.88 63.12,24.88 61.62,11.62 63.12,11.62 62.38,11.62 61.62,10.94 62.38,10.94 63.12,10.94 61.62,4.06 63.12,4.06 62.38,4.06 61.62,3.38 62.38,3.38 63.12,3.38 62.62,14.56 63.38,14.56 64.12,14.56 62.62,13.88 63.38,13.88 64.12,13.88 62.69,22.12 63.38,22.12 64.12,22.12 64.12,21.44 63.38,21.44 62.69,21.44 62.69,43.62 63.44,43.62 64.12,43.62 62.69,42.94 63.44,42.94 64.12,42.94 63.38,36.06 64.12,36.06 62.62,36.06 62.62,35.38 63.38,35.38 64.12,35.38 38.5,7 34,10.38 34,12.75 34,15.25 34,20.5 34,24.5 38.5,30 34,35 32,38 51,41 51,35.5 48.25,29.75 53.5,25 48.25,18.19 50.5,13 48.25,6.75 51,2 53.5,4.5 53.5,13 53.5,33.25 53.5,38 39.5,38.5 39,35.5 45.5,35.5 45.5,29.75 39.5,27 39,23.5 38.5,18 39.5,15 39.5,13 46.5,13 45.5,6.75 39.25,4.19 34,2.25 45.5,2 24.12,28 18.5,21.5 24.5,4 18.5,2.25 53.5,20.5 43.5,41 43.5,35.5 43.5,25 43.69,18 43.69,13 43.69,6.75 31.56,8.69 18.5,8.88 18.5,14 4.88,33.31 4.88,14.31 5.5,14.31 6.12,14.31 6.12,13.69 5.5,13.69 4.88,13.69 31.88,24.5 27.06,14.44 28.94,14.44 28.94,12.56 27.06,12.56 29.5,8.75 22.5,37.94 28.94,32.94 28.94,31.06 39.38,9.62 40.5,43.81 38.5,41.5 27.06,31.06 20.12,21.5 21.38,21.5 3.5,38 3.5,9 25.69,17.5 27.5,8.5 27.19,26.75 18.5,33.69 22.56,33.69 18.5,31.88 18.5,29.94 18.5,27.75 15,42.19 12.19,37.75 30.62,28.5 5.5,31 5.5,16 1.25,25.25 26.62,28.5 31.88,29.25 28.62,28.5 25.94,9.06 34,32.31 28.62,38 45.5,45.5 41.5,42 41.5,30.5 46,25 39.5,20.5 41.5,18.5 41.5,8 43.5,2.5 53.5,10.31 59.5,12 59.5,23.5 59.5,35 59.5,45.5 59.5,2 45.5,22.5 10.06,25.31 34.25,30.5 39.25,32.38 1.25,22 27.06,13.5 28.94,13.5 28,12.56 27.99,13.48 27.06,32 27.99,31.98 28.94,32 28,31.06 22.69,22.5 24.06,22.5 25.38,22.5 25.06,36.44 24.31,9 24.12,11.25 32.5,4 27.06,32.94 22.5,42.19 30.62,42.19 17.81,37.81 16,37.75 19.75,36.5 10,23.5
  pour Top (isolate 0.254): 0,0 0,47 65,47 65,0
  pour Bottom (isolate 0.254): 0,0 0,47 65,47 65,0
IN1A  (via drill 0.3)
  Top 0.254: v24.5,14.5 25.25,13.75 IC5.21 | IC10.21 25.42,32.25 24.73,32.94 v23.38,32.94 18.69,32.94 v10,24.25 J2-HEADER.28 J2-HEADER.27
  Bottom 0.254: v23.38,32.94 23.38,15.62 v24.5,14.5 | v10,24.25 9,25.25 J1-RECEPT.23 J1-RECEPT.24
IN1B  (via drill 0.3)
  Top 0.254: J2-HEADER.32 J2-HEADER.31 1.75,23.25 v1.25,23.75
  Bottom 0.254: J1-RECEPT.27 J1-RECEPT.28 1.75,24.25 v1.25,23.75
LRCK  (via drill 0.3)
  Top 0.254: v20.75,12.75 21.62,11.88 24.17,11.88 25.04,12.75 IC5.23 | IC10.23 24.98,31.25 24.23,30.5 v20.75,30.5 20,30.5 10.75,21.25 v10,21.25 J2-HEADER.40 J2-HEADER.39
  Bottom 0.254: v10,21.25 J1-RECEPT.39 J1-RECEPT.40 | v20.75,30.5 v20.75,12.75
MICBIAS
  Top 0.254: R35.2 31.56,4.41 31.56,7.67 28.75,10.48 IC5.5
N$5
  Top 0.254: IC8.2 37.17,37.18 R55.1 38.15,36.5 39.15,37.5 R50.2
N$6
  Top 0.254: IC4.3 37.82,16.32 38,16.5 39,16.5 39.5,16 42.2,16 42.35,16.15 R24.1 43.8,16.15 R20.1 46.9,16.85 C13.2
N$8
  Top 0.254: IC4.5 39.97,19.61 40.42,19.16 R25.1 41,19.66 43.99,19.66 R21.1 44.9,19.55 C14.2
N$9
  Top 0.254: IC3.3 37.82,5.32 38,5.5 39,5.5 39.5,5 41.85,5 R22.1 44.2,5.65 R18.1 44.6,5.45 C11.2
N$10
  Top 0.254: IC3.5 39.72,8.61 40.17,8.16 R23.1 41.25,8.91 44.24,8.91 R19.1 45.4,8.65 46,8.05 C12.2
N$11
  Top 0.254: IC8.6 37.82,44.47 R56.1 R51.2
N$12
  Top 0.254: IC7.2 37.17,25.68 R53.1 38.35,25 39.35,26 R48.2
N$13
  Top 0.254: IC3.6 37.82,9.61 38.29,10.07 R31.1 39.96,10.69 R27.2
N$14
  Top 0.254: IC7.6 37.82,33.04 R54.1 38.96,33.69 39.65,33 R49.2
N$15
  Top 0.254: C7.1 51.9,5.45 R14.2
N$16
  Top 0.254: R15.2 51.9,8.05 C8.1
N$17
  Top 0.254: C35.2 46.9,39.35 R42.1 44.2,39.65 R46.1 42.35,39.5 39.5,39.5 39,40 38.37,40 37.82,39.46 IC8.3
N$18
  Top 0.254: C9.1 51.9,16.95 R16.2
N$19
  Top 0.254: C36.2 46.95,42.5 46,42.5 45.85,42.65 R43.1 44.46,42.61 43.99,43.08 41.04,43.08 R47.1 39.92,43.11 IC8.5
N$20
  Top 0.254: C33.2 44.6,28.45 R40.1 44.3,28.15 R44.1 42.35,28 39.5,28 39,28.5 38,28.5 37.82,28.32 IC7.3
N$21
  Top 0.254: C34.2 46.95,31 46,31 45.85,31.15 R41.1 44.05,31.6 41,31.6 R45.1 40,31.1 39.49,31.61 IC7.5
N$22
  Top 0.254: C29.1 51.9,28.45 R36.2
N$23
  Top 0.254: C30.1 51.9,31.05 R37.2
N$25
  Top 0.254: C31.1 51.9,39.45 R38.2
N$26
  Top 0.254: C32.1 51.9,42.55 R39.2
N$27
  Top 0.254: C10.1 51.9,19.55 R17.2
N$31
  Top 0.254: IC4.2 37.17,13.68 R32.1 38,13 39,14 R28.2
N$32
  Top 0.254: IC4.6 37.82,21.32 38.12,21.62 R33.1 39.02,21.62 39.4,21.25 R29.2
N$33
  Top 0.254: IC3.2 37.17,3.68 37.85,3 R30.1 38.5,2 40,3.5 R26.2
SCL  (via drill 0.3)
  Top 0.254: IC5.17 27.25,16.88 v26.88,17.25 | IC10.17 27.25,35.31 v26.73,35.83 25.31,37.25 19.56,37.25 10.04,27.73 v10.03,27.73 v10.03,27.72 9.56,27.25 J2-HEADER.16 J2-HEADER.15
  Bottom 0.254: v26.88,17.25 26.04,18.08 26.04,34.17 26.73,34.86 v26.73,35.83 | v10.03,27.73 9.55,27.25 J1-RECEPT.15 J1-RECEPT.16
SDA  (via drill 0.3)
  Top 0.254: v25.32,35.51 26.75,34.09 IC10.18 | v19.75,35.5 19.31,35.5 v10.06,26.25 J2-HEADER.20 J2-HEADER.19 | IC5.18 26.7,15.55 v25.75,16.5
  Bottom 0.254: v25.75,16.5 24.75,17.5 24.75,34.94 v25.32,35.51 v25.31,35.5 v19.75,35.5 | v10.06,26.25 J1-RECEPT.19 J1-RECEPT.20
SHDN  (via drill 0.3)
  Top 0.254: IC10.14 28.75,35.12 v29.69,36.06 25.75,40 17.38,40 v10.06,32.69 9,31.62 9,30.5 8.75,30.25 J2-HEADER.4 J2-HEADER.3 | v29.5,16.81 28.75,16.06 IC5.14
  Bottom 0.254: v29.69,36.06 31.25,34.5 31.25,18.56 v29.5,16.81 | v10.06,32.69 9,31.62 9,30.5 8.75,30.25 J1-RECEPT.3 J1-RECEPT.4
VDD  (via drill 0.3)
  Top 0.254: IC10.19 24.6,34.65 C48.2 C50.2 21.04,34.25 v19.12,34.25 | IC5.16 27.75,16.44 28,16.69 28,17.88 27.56,18.31 25.31,18.31 24.6,17.6 24.6,16.1 | v19.12,17.06 20.54,15.65 C28.2 C26.2 24.15,15.65 24.6,16.1 | v18.25,38.75 17.87,38.75 10.06,30.94 v10.06,30.75 10.06,30.5 8.81,29.25 J2-HEADER.8 J2-HEADER.7 1.75,29.25 v1.25,29.75 | IC5.19 24.6,16.1
  Bottom 0.254: v19.12,17.06 v19.12,34.25 19.12,38.38 18.75,38.75 v18.25,38.75 | v10.06,30.75 10.06,30.56 8.75,29.25 J1-RECEPT.7 J1-RECEPT.8 1.75,29.25 v1.25,29.75
VDDA  (via drill 0.3)
  Top 0.254: IC5.1 25.25,10 25.25,8.97 23.25,6.97 C23.2 | IC10.1 25.5,28.75 25.5,27.85 C45.2 C46.2 | 34.98,19.48 v35,19.5 35.11,19.61 IC4.8 | v35.5,43 35.61,43.11 IC8.8 | v35,30.5 36.11,31.61 IC7.8 | v35,9 36.14,9 IC3.8
  Top 0.406: C40.1 34.4,43 v35.5,43 | v35,22.19 34.16,21.35 C3.1 31.27,21.45 IC2.5 | C46.2 19.9,25.35 v18.5,26.75 | C23.2 C24.2 21.04,6.85 v21.75,7.56 | 34.98,19.48 C18.1 | C39.1 35,30.29 v35,30.5 | v35,9 34.12,8.12 C17.1
  Bottom 0.406: v21.75,7.56 33.56,7.56 v35,9 v35,19.5 v35,22.19 v35,30.5 35,37.5 | v35.5,43 35,42.5 35,37.5 | v18.5,26.75 17,28.25 17,39 17.5,39.5 33,39.5 35,37.5
VGND  (via drill 0.3)
  Top 0.254: R47.2 41.99,40.84 R46.2 v42.5,42.5 | R45.2 42.05,29.4 R44.2 v42.5,31 | C38.1 R50.1 42.35,38.35 v42.5,38.5 | C37.1 R48.1 42.35,26.85 v42.5,27 | R25.2 42.11,17.46 R24.2 v42.5,19 | R23.2 41.11,6.46 42,7.35 R22.2 v42.5,8.31 | R27.1 42.48,10.12 42.48,10.97 v42.5,11 | C16.1 R26.1 42.35,4.35 v42.5,4.5 | C15.1 R28.1 42.35,14.85 v42.5,15 | v32.5,3 32.5,2.96 31.19,1.65 R35.1 R34.2 C19.2 26.46,1.69 R1.2 | R49.1 42.35,33.85 v42.5,34 | R51.1 42.5,44.85 v42.5,44 | v42.5,22.44 42.5,21.4 R29.1
  Bottom 0.254: v42.5,44 v42.5,42.5 v42.5,38.5 v42.5,34 v42.5,31 v42.5,27 v42.5,22.44 v42.5,19 v42.5,15 v42.5,11 v42.5,8.31 v42.5,4.5 41,3 v32.5,3
VGND1  (via drill 0.3)
  Top 0.254: J2-HEADER.54 9.57,17.75 9.82,17.5 v10,17.5 15,12.5 15,7.5 20.81,1.69 R1.1
  Bottom 0.254: v10,17.5 9.84,17.5 9.59,17.75 J1-RECEPT.53
VREF-A
  Top 0.254: C20.2 30,7.23 27.75,9.48 IC5.3
VREF-B
  Top 0.254: IC10.3 27.75,28.16 30.06,25.85 C42.2

### Text on the board
tNames: 8 | Bx2 | 5 | 8 | B/8 | 5 | 4 | Ax2 | 1 | 4 | A/8 | by ThunderLab, 2026 | 1
bNames: 8 | Bx2 | 5 | 8 | B/8 | 5 | 4 | Ax2 | 1 | 4 | A/8 | 1